# Altium schematic sheet RFTuningBoard.SchDoc: RF Tuning Board
size B; Author: Sébastien Gélinas; Organization: SmartHalo; Address1: 5445 de Gaspé; Address2: Montréal, QC; Address3: Canada; Address4: H2T 3B2; Revision: 1; SheetNumber: 1; SheetTotal: 1
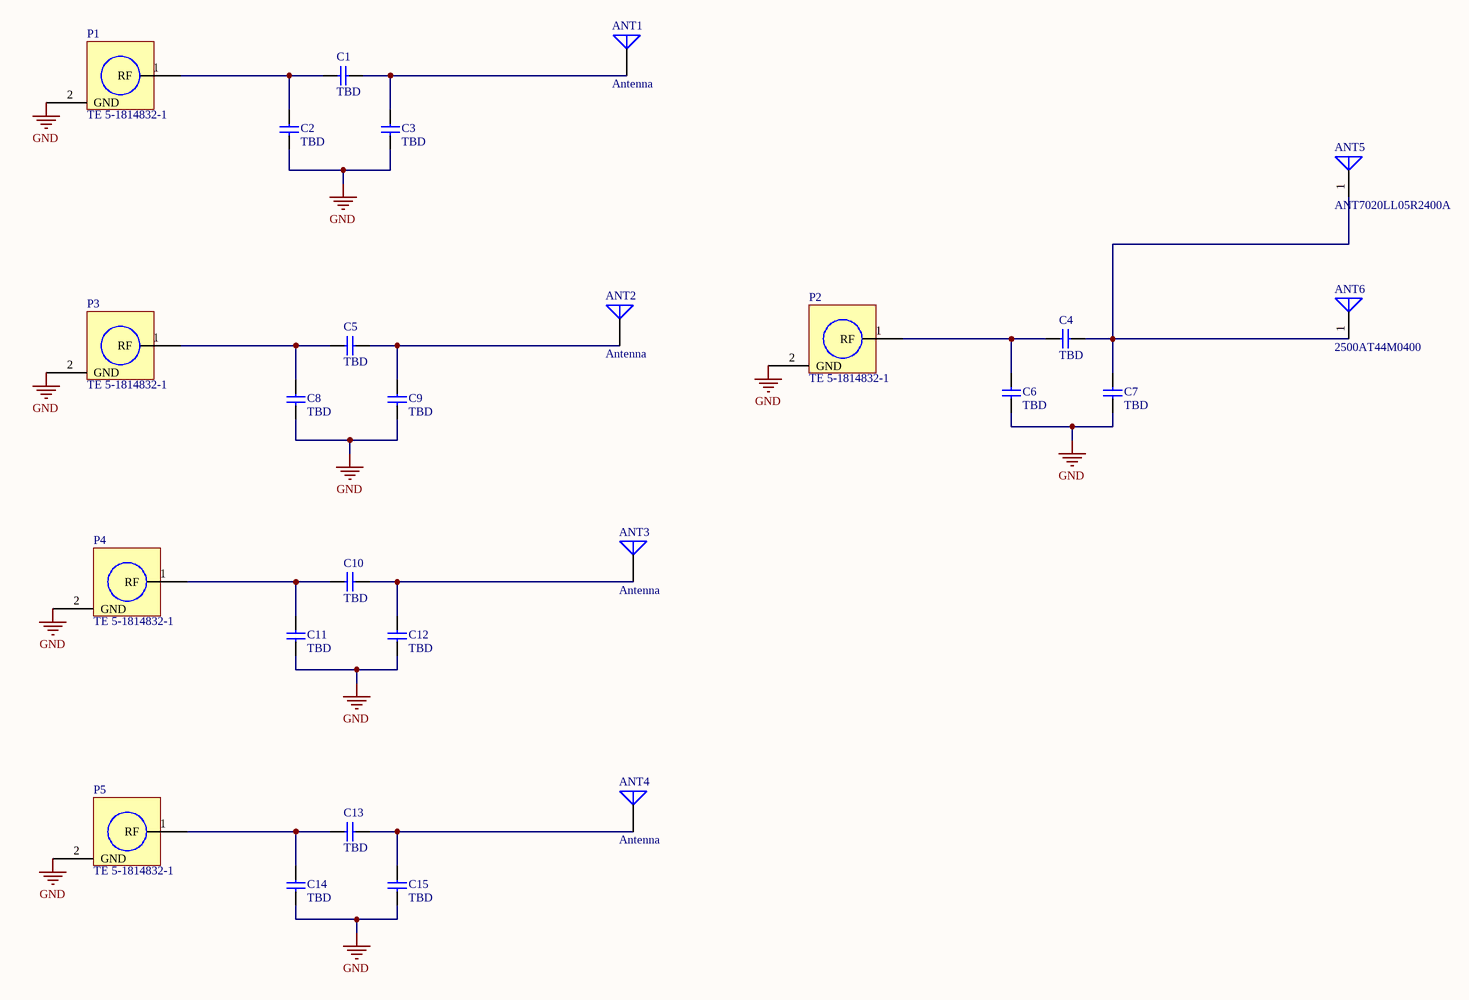
[diagram p0: RFTuningBoard.SchDoc]

## Parts
ANT1  Antenna  [ANTENNA_PCB_2.4GHZ]  (no BOM)
ANT2  Antenna  [ANT_2.4GHZ_FR408_4L_CMIFA]  (no BOM)
ANT3  Antenna  [ANT_2.4GHZ_FR408_4L_Meander]  (no BOM)
ANT4  Antenna  [ANT_2.4GHZ_FR408_4L_TIFA]  (no BOM)
ANT5  ANT7020LL05R2400A  [ANT7020LL05R2400A]
ANT6  2500AT44M0400  [2500AT44M0400]
C1  TBD  [CAPC0603(1608)100_N]
C2  TBD  [CAPC0603(1608)100_N]
C3  TBD  [CAPC0603(1608)100_N]
C4  TBD  [CAPC0603(1608)100_N]
C5  TBD  [CAPC0603(1608)100_N]
C6  TBD  [CAPC0603(1608)100_N]
C7  TBD  [CAPC0603(1608)100_N]
C8  TBD  [CAPC0603(1608)100_N]
C9  TBD  [CAPC0603(1608)100_N]
C10  TBD  [CAPC0603(1608)100_N]
C11  TBD  [CAPC0603(1608)100_N]
C12  TBD  [CAPC0603(1608)100_N]
C13  TBD  [CAPC0603(1608)100_N]
C14  TBD  [CAPC0603(1608)100_N]
C15  TBD  [CAPC0603(1608)100_N]
P1  TE 5-1814832-1  [TE_SMA_TH]
P2  TE 5-1814832-1  [TE_SMA_TH]
P3  TE 5-1814832-1  [TE_SMA_TH]
P4  TE 5-1814832-1  [TE_SMA_TH]
P5  TE 5-1814832-1  [TE_SMA_TH]

## Nets
GND: ANT2.2(GND) ANT4.2(GND) C2.2 C3.2 C6.2 C7.2 C8.2 C9.2 C11.2 C12.2 C14.2 C15.2 P1.2(GND) P2.2(GND) P3.2(GND) P4.2(GND) P5.2(GND)
NetANT1_1: ANT1.1(Feed) C1.2 C3.1
NetANT2_1: ANT2.1(Feed) C5.2 C9.1
NetANT3_1: ANT3.1(Feed) C10.2 C12.1
NetANT4_1: ANT4.1(Feed) C13.2 C15.1
NetANT5_1: ANT5.1(Feed) ANT6.1(Feed) C4.2 C7.1
NetC1_1: C1.1 C2.1 P1.1(RF)
NetC4_1: C4.1 C6.1 P2.1(RF)
NetC5_1: C5.1 C8.1 P3.1(RF)
NetC10_1: C10.1 C11.1 P4.1(RF)
NetC13_1: C13.1 C14.1 P5.1(RF)

## Notes on the sheet
- Title
- Size:
- Date:
- B
- Author:
- Time:
- Sheet
- Revision:
- of
- File:

## Library data of the parts
ANT1 ANT3 = ANTENNA_PCB_2.4GHz: Antenna PCB, 2.4GHz, 26.11 mm x 1.27 mm, FR4 60 mils, Er = 4.2
ANT2 ANT4 = ANTENNA_PCB_2.4GHz_2PINS: Antenna PCB, 2.4GHz
ANT5 = ANT7020LL05R2400A: CHIP ANTENNA, 2.45GHz, 7 x 2 mm body; Manufacturer: Yageo; PartNumber: ANT7020LL05R2400A; Manufacturer Part Number: ANT7020LL05R2400A
ANT6 = 2500AT44M0400: CHIP ANTENNA, 2.45GHz, 8 x 1 mm body; Manufacturer: Johanson Technology; PartNumber: 2500AT44M0400; Manufacturer Part Number: 2500AT44M0400
C1-C15 = CAP0603: Chip Cap 0603 X7R 10%; Case-EIA: 0603; Value: TBD
P1-P5 = 5-1814832-1: CONN SMA JACK STR 50 OHM PCB; Manufacturer: TE Connectivity